# Altium schematic sheet 3V3_Isolation.SchDoc
size A
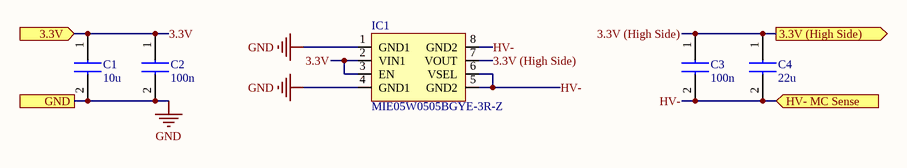
[diagram p0: 3V3_Isolation.SchDoc]

## Parts
C1  10u  [CAPC1608X90N]
C2  100n  [CAPC1608X90N]
C3  100n  [CAPC1608X90N]
C4  22u  [CAPC1608X105N]
IC1  MIE05W0505BGYE-3R-Z  [SOIC127P1030X265-8N]

## Ports
3.3V (High Side) (out), 3.3V (in), GND, HV- MC Sense (in)

## Nets
GND: C1.2 C2.2 IC1.1(GND1) IC1.4(GND1) ; port GND
3.3V: C1.1 C2.1 IC1.2(VIN1) IC1.3(EN) ; port 3.3V
3.3V (High Side): C3.1 C4.1 IC1.7(VOUT) ; port 3.3V (High Side)
HV-: C3.2 C4.2 IC1.5(GND2) IC1.6(VSEL) IC1.8(GND2) ; port HV- MC Sense

## Library data of the parts
C1 = CL10A106KQ8NNNL: Capacitor; Manufacturer_Name: SAMSUNG; Datasheet Link: https://product.samsungsem.com/mlcc/basic-search.do?partNumber=CL10A106KQ8NNN; Height: 0.9mm; Manufacturer_Part_Number: CL10A106KQ8NNNL; Mouser Part Number: N/A; Mouser Price/Stock: https://www.mouser.com/Search/Refine.aspx?Keyword=N%2FA; Arrow Part Number: CL10A106KQ8NNNL; Arrow Price/Stock: https://www.arrow.com/en/products/cl10a106kq8nnnl/samsung-electro-mechanics
C2 C3 = 06035C104J4Z2A: Capacitor; Manufacturer_Name: Kyocera AVX; Datasheet Link: https://componentsearchengine.com/Datasheets/1/06031A100FAT2A.pdf; Height: 0.9mm; Manufacturer_Part_Number: 06035C104J4Z2A; Mouser Part Number: 581-06035C104J4Z2A; Mouser Price/Stock: https://www.mouser.co.uk/ProductDetail/KYOCERA-AVX/06035C104J4Z2A?qs=Awwwc1gvTnlncvTGCFZvkw%3D%3D; Arrow Part Number: 06035C104J4Z2A; Arrow Price/Stock: https://www.arrow.com/en/products/06035c104j4z2a/avx
C4 = CL10A226MP8NUNE: Capacitor; Manufacturer_Name: SAMSUNG; Datasheet Link: https://datasheet.datasheetarchive.com/originals/distributors/Datasheets-DGA10/2407063.pdf; Height: 1.05mm; Manufacturer_Part_Number: CL10A226MP8NUNE; Mouser Part Number: 187-CL10A226MP8NUNE; Mouser Price/Stock: https://www.mouser.co.uk/ProductDetail/Samsung-Electro-Mechanics/CL10A226MP8NUNE?qs=gRKWieUq2Hb5O0PTfRKzDQ%3D%3D; Arrow Part Number: CL10A226MP8NUNE; Arrow Price/Stock: https://www.arrow.com/en/products/cl10a226mp8nune/samsung-electro-mechanics?utm_currency=USD&region=europe